# EasyEDA Pro project ProPrj_11年并联dc_2024-12-13.epro

# Schematic Schematic1
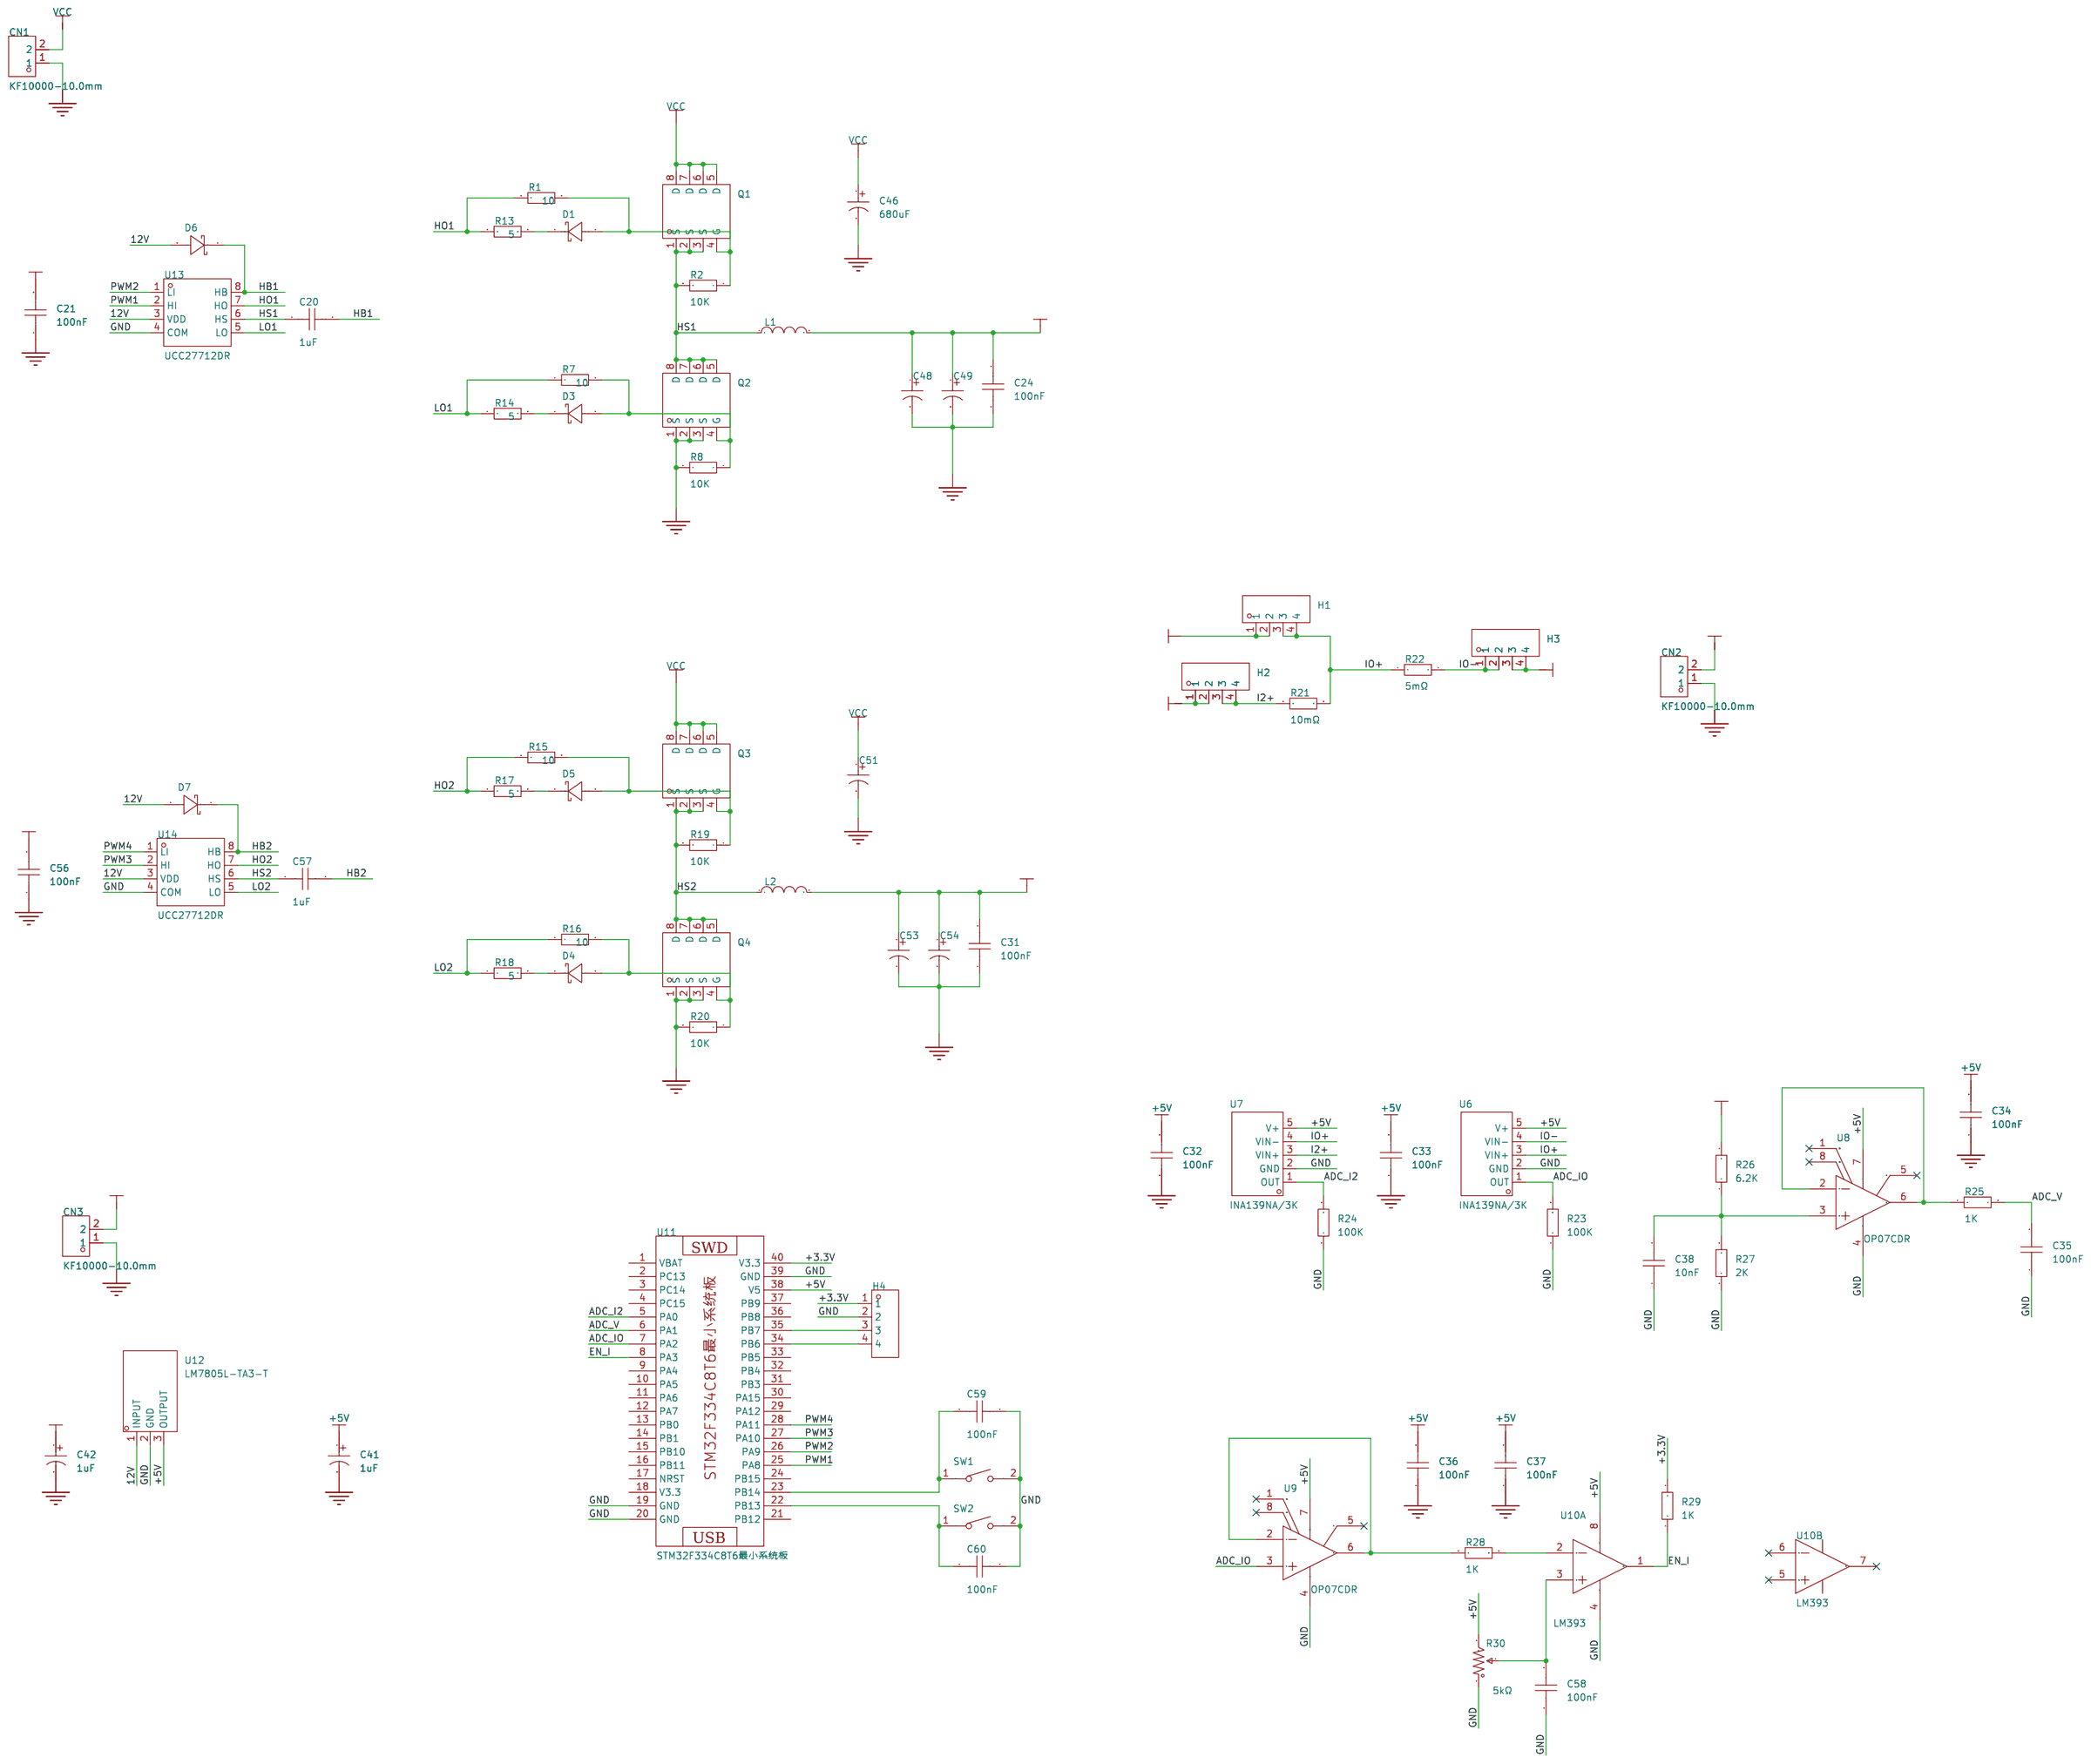
[diagram p0: schematic sheet]

## Parts
C20  1uF  [C0603]
C21  100nF  [C0603]
C24  100nF  [C0603]
C31  100nF  [C0603]
C32  100nF  [C0603]
C33  100nF  [C0603]
C34  100nF  [C0603]
C35  100nF  [C0603]
C36  100nF  [C0603]
C37  100nF  [C0603]
C38  10nF  [C0603]
C41  1uF  [CAP-TH_BD5.0-P2.00-D0.8-FD]
C42  1uF  [CAP-TH_BD5.0-P2.00-D0.8-FD]
C46  680uF  [CAP-TH_BD12.5-P5.00-D0.6-FD]
C48  680uF  [CAP-TH_BD12.5-P5.00-D0.6-FD]
C49  680uF  [CAP-TH_BD12.5-P5.00-D0.6-FD]
C51  680uF  [CAP-TH_BD12.5-P5.00-D0.6-FD]
C53  680uF  [CAP-TH_BD12.5-P5.00-D0.6-FD]
C54  680uF  [CAP-TH_BD12.5-P5.00-D0.6-FD]
C56  100nF  [C0603]
C57  1uF  [C0603]
C58  100nF  [C0603]
C59  100nF  [C0603]
C60  100nF  [C0603]
CN1  KF10000-10.0mm  [CONN-TH_2P-P10.00_KF10000-10.0MM]
CN2  KF10000-10.0mm  [CONN-TH_2P-P10.00_KF10000-10.0MM]
CN3  KF10000-10.0mm  [CONN-TH_2P-P10.00_KF10000-10.0MM]
D1  1N5819WS S4  [SOD-323_L1.6-W1.3-LS2.7-RD]
D3  1N5819WS S4  [SOD-323_L1.6-W1.3-LS2.7-RD]
D4  1N5819WS S4  [SOD-323_L1.6-W1.3-LS2.7-RD]
D5  1N5819WS S4  [SOD-323_L1.6-W1.3-LS2.7-RD]
D6  1N5819WS S4  [SOD-323_L1.6-W1.3-LS2.7-RD]
D7  1N5819WS S4  [SOD-323_L1.6-W1.3-LS2.7-RD]
H1  -  [HDR-TH_4P-P2.54-V-M]
H2  -  [HDR-TH_4P-P2.54-V-M]
H3  -  [HDR-TH_4P-P2.54-V-M]
H4  -  [HDR-TH_4P-P2.54-V-M]
L1  L-SMD1010-PCB  [IND-SMD_L10.0-W10.0-2]
L2  L-SMD1010-PCB  [IND-SMD_L10.0-W10.0-2]
Q1  CSD18540Q5BT  [PDFNWB-8L_L6.0-W5.0-P1.27-BL-EP]
Q2  CSD18540Q5BT  [PDFNWB-8L_L6.0-W5.0-P1.27-BL-EP]
Q3  CSD18540Q5BT  [PDFNWB-8L_L6.0-W5.0-P1.27-BL-EP]
Q4  CSD18540Q5BT  [PDFNWB-8L_L6.0-W5.0-P1.27-BL-EP]
R1  10  [R0603]
R2  10K  [R0603]
R7  10  [R0603]
R8  10K  [R0603]
R13  5  [R0603]
R14  5  [R0603]
R15  10  [R0603]
R16  10  [R0603]
R17  5  [R0603]
R18  5  [R0603]
R19  10K  [R0603]
R20  10K  [R0603]
R21  10mΩ  [R1206]
R22  5mΩ  [R1206]
R23  100K  [R0603]
R24  100K  [R0603]
R25  1K  [R0603]
R26  6.2K  [R0603]
R27  2K  [R0603]
R28  1K  [R0603]
R29  1K  [R0603]
R30  5kΩ  [RES-ADJ-TH_3P-L9.5-W4.85-P2.50-BL-BS]
SW1  轻触按键3*4*H  [SW-SMD_L4.0-W2.9-LS5.0]
SW2  轻触按键3*4*H  [SW-SMD_L4.0-W2.9-LS5.0]
U6  INA139NA/3K  [SOT-23-5_L3.0-W1.7-P0.95-LS2.8-BR]
U7  INA139NA/3K  [SOT-23-5_L3.0-W1.7-P0.95-LS2.8-BR]
U8  OP07CDR  [SOIC-8_L4.9-W3.9-P1.27-LS6.0-BL]
U9  OP07CDR  [SOIC-8_L4.9-W3.9-P1.27-LS6.0-BL]
U10  LM393  [SOP-8_L4.9-W3.9-P1.27-LS6.0-BL]  (sections 1,2)
U11  STM32F334C8T6最小系统板  [STM32F103C8T6核心板]
U12  LM7805L-TA3-T  [TO-220IS_L10.16-W4.7-P2.54-L]
U13  UCC27712DR  [SOIC-8_L4.9-W3.9-P1.27-LS6.0-BL]
U14  UCC27712DR  [SOIC-8_L4.9-W3.9-P1.27-LS6.0-BL]

## Library data of the parts
C20 C21 C24 C31-C38 C56-C60 = CAP_0603: Supplier Footprint: 0603
C41 C42 = KF010M050C110A: 容值:1uF;精度:±20%;额定电压:50V;; LCSC Part Name: 1uF ±20% 50V; Supplier Part: C62934; Manufacturer: CapXon(丰宾); Supplier Footprint: 插件,D5xL11mm; JLCPCB Part Class: 扩展库; Datasheet: https://atta.szlcsc.com/upload/public/pdf/source/20160702/1467448308274.pdf; Supplier: LCSC; Tolerance: ±20%; Rated Voltage: 50V; Lead Spacing: 2mm; φD: 5mm; L: 11mm; Lifetime @ Temp: 2000hrs@105℃
C46 C48 C49 C51 C53 C54 = ERR1JM681W25OT: 容值:680uF;精度:±20%;额定电压:63V;; LCSC Part Name: 680uF ±20% 63V; Supplier Part: C106632; Manufacturer: AISHI(艾华集团); Supplier Footprint: 插件,D12.5xL25mm; JLCPCB Part Class: 扩展库; Datasheet: https://atta.szlcsc.com/upload/public/pdf/source/20190702/C401591_1676EF45BC9A88BD1D6B22BBAE3913C7.pdf; Supplier: LCSC; Tolerance: ±20%; Rated Voltage: 63V; Lead Spacing: 5mm; φD: 12.5mm; L: 25mm; Lifetime @ Temp: 2000hrs@105℃
CN1-CN3 = KF10000-10.0mm: Supplier Part: C9900018859; JLCPCB Part Class: 扩展库; Supplier: LCSC
D1 D3-D7 = 1N5819WS S4_C2927280: 二极管配置:独立式;正向压降(Vf):600mV@200mA;直流反向耐压(Vr):40V;平均整流电流(Io):350mA;; LCSC Part Name: 电压:40V 电流:350mA; Supplier Part: C2927280; Manufacturer: JSMSEMI(杰盛微); Supplier Footprint: SOD-323; JLCPCB Part Class: 扩展库; Datasheet: https://atta.szlcsc.com/upload/public/pdf/source/20240105/574E572B69D2DF1CD36E5C05FAB269C4.pdf; Supplier: LCSC; Diode Configuration: 独立式; Forward Voltage (Vf@If): 600mV@200mA; Reverse Voltage (Vr): 40V; Average Rectified Current (Io): 350mA; Reverse Leakage Current (Ir): 5uA@30V
H1-H4 = HDR-M_2.54_1x4P: Supplier Part: C492403; Supplier Footprint: 插件
L1 L2 = L-SMD1010-PCB: Supplier Part: C9900024506; Supplier Footprint: 贴片电感; JLCPCB Part Class: 扩展库; Supplier: LCSC
Q1-Q4 = CSD18540Q5BT: 60V、N 通道 NexFET&#153; 功率 MOSFET 8-VSON-CLIP -55 to 175; Supplier Part: C2863985; Manufacturer: TI(德州仪器); Supplier Footprint: VSON-CLIP-8(6x5); JLCPCB Part Class: 扩展库; Supplier: LCSC
R1 R2 R7 R8 R13-R20 R23-R29 = Res_0603: Supplier Footprint: 0603
R21 R22 = Res_1206: Supplier Footprint: 1206
R30 = 3296W-1-502: 阻值:5kΩ;精度:±10%;; LCSC Part Name: 5kΩ ±10%; Supplier Part: C118907; Manufacturer: BOCHEN(博晨); Supplier Footprint: 插件; JLCPCB Part Class: 扩展库; Datasheet: https://atta.szlcsc.com/upload/public/pdf/source/20171114/C118907_15106326547951117397.pdf; Supplier: LCSC; Tolerance: ±10%
SW1 SW2 = 轻触按键3*4*H: Supplier Part: C9900017573; Supplier Footprint: 轻触按键3*4*2.5; JLCPCB Part Class: 扩展库; Supplier: LCSC
U6 U7 = INA139NA/3K: INA139 36V、高侧、高速、电流输出电流分流监控器; Supplier Part: C129947; Manufacturer: TI(德州仪器); Supplier Footprint: SOT-23-5; JLCPCB Part Class: 扩展库; Datasheet: https://www.ti.com/cn/lit/gpn/ina139; Supplier: LCSC; Supply Voltage: 2.7V~40V; Operating Temperature: -40℃~+125℃
U8 U9 = OP07CDR: 放大器数:单路;增益带宽积(GBP):600kHz;输入偏置电流(Ib):1.8nA;压摆率(SR):0.3V/us;轨到轨:-;; LCSC Part Name: 精密运算放大器; Supplier Part: C7433; Manufacturer: TI(德州仪器); Supplier Footprint: SOIC-8; JLCPCB Part Class: 基础库; Datasheet: http://www.ti.com/cn/lit/gpn/op07c; Supplier: LCSC; Number of Circuits: 单路; Gain Bandwidth Product(GBP): 600kHz; Current - Input Bias(Ib): 1.8nA; Slew Rate(SR): 0.3V/us; Operating Temperature: 0℃~+70℃
U10 = LM393_C400839: 输入失调电压(Vos):3mV;输入偏置电流(Ib):-;轨到轨:-;; Supplier Part: C400839; Manufacturer: IDCHIP(英锐芯); Supplier Footprint: SOP-8; JLCPCB Part Class: 扩展库; Datasheet: https://atta.szlcsc.com/upload/public/pdf/source/20240308/5ED8EE163AE67417F731F81F7E9D3786.pdf; Supplier: LCSC; Input Offset Voltage (Vos): 3mV; Supply Voltage: 24V; Supply Current: 2.5mA
U11 = STM32F103C8T6最小系统板: tags: STM32; Supplier Part: C8734; Manufacturer: 无; Manufacturer Part: STM32F103C8T6最小系统模块; image: http://image.lceda.cn/szlcsc/C8734.jpg; JLCPCB Part Class: Basic Part
U12 = LM7805L-TA3-T_C340686: 输出类型:-;; Supplier Part: C340686; Supplier Footprint: TO-220IS; JLCPCB Part Class: 扩展库; Supplier: LCSC
U13 U14 = UCC27712DR: 驱动配置:半桥;负载类型:MOSFET；IGBT;驱动通道数:2;峰值灌电流:2.8A;峰值拉电流:1.8A;电源电压:10V~20V;上升时间:16ns;下降时间:10ns;; Supplier Part: C485818; Manufacturer: TI(德州仪器); Supplier Footprint: SOIC-8; JLCPCB Part Class: 扩展库; Datasheet: https://www.ti.com/cn/lit/gpn/ucc27712; Supplier: LCSC; Driven Configuration: 半桥; Load Type: MOSFET；IGBT; Number of Drivers: 2; Peak Output Current(sink): 2.8A; Peak Output Current(source): 1.8A; Supply Voltage: 10V~20V; Rise Time: 16ns; Fall Time: 10ns; Operating Temperature: -40℃~+125℃@(Tj)

## Nets
12V: C21.2 C42.1 C56.2 CN3.2 D6.2(A) D7.2(A) U12.1(INPUT) U13.3(VDD) U14.3(VDD)
+3.3V: H4.1 R29.2 U11.40(V3.3)
+5V: C32.2 C33.2 C34.2 C36.2 C37.2 C41.1 R30.3 U6.5(V+) U7.5(V+) U8.7(VCC+) U9.7(VCC+) U10.8(VCC) U11.38(V5) U12.3(OUTPUT)
GND: C21.1 C24.1 C31.1 C32.1 C33.1 C34.1 C35.1 C36.1 C37.1 C38.1 C41.2 C42.2 C46.2 C48.2 C49.2 C51.2 C53.2 C54.2 C56.1 C58.1 C59.2 C60.2 CN1.1 CN2.1 CN3.1 H4.2 Q2.1(S) Q2.2(S) Q2.3(S) Q4.1(S) Q4.2(S) Q4.3(S) R8.2 R20.2 R23.1 R24.1 R27.1 R30.1 SW1.2 SW2.2 U6.2(GND) U7.2(GND) U8.4(VCC-) U9.4(VCC-) U10.4(GND) U11.19(GND) U11.20(GND) U11.39(GND) U12.2(GND) U13.4(COM) U14.4(COM)
VCC: C46.1 C51.1 CN1.2 Q1.5(D) Q1.6(D) Q1.7(D) Q1.8(D) Q3.5(D) Q3.6(D) Q3.7(D) Q3.8(D)
ADC_I2: R24.2 U7.1(OUT) U11.5(PA0)
ADC_IO: R23.2 U6.1(OUT) U9.3(IN+) U11.7(PA2)
ADC_V: C35.2 R25.2 U11.6(PA1)
EN_I: R29.1 U10.1(OUTA) U11.8(PA3)
HB1: C20.2 D6.1(C) U13.8(HB)
HB2: C57.2 D7.1(C) U14.8(HB)
HO1: R1.1 R13.1 U13.7(HO)
HO2: R15.1 R17.1 U14.7(HO)
HS1: C20.1 L1.1 Q1.1(S) Q1.2(S) Q1.3(S) Q2.5(D) Q2.6(D) Q2.7(D) Q2.8(D) R2.2 U13.6(HS)
HS2: C57.1 L2.1 Q3.1(S) Q3.2(S) Q3.3(S) Q4.5(D) Q4.6(D) Q4.7(D) Q4.8(D) R19.2 U14.6(HS)
I2+: H2.3 H2.4 R21.1 U7.3(VIN+)
IO+: H1.3 H1.4 R21.2 R22.1 U6.3(VIN+) U7.4(VIN-)
IO-: H3.1 H3.2 R22.2 U6.4(VIN-)
LO1: R7.1 R14.1 U13.5(LO)
LO2: R16.1 R18.1 U14.5(LO)
OUT: CN2.2 H3.3 H3.4 R26.2
OUT1: C24.2 C48.1 C49.1 H1.1 H1.2 L1.2
OUT2: C31.2 C53.1 C54.1 H2.1 H2.2 L2.2
PWM1: U11.25(PA8) U13.2(HI)
PWM2: U11.26(PA9) U13.1(LI)
PWM3: U11.27(PA10) U14.2(HI)
PWM4: U11.28(PA11) U14.1(LI)
$1N1590: D3.2(A) Q2.4(G) R7.2 R8.1
$1N2076: D1.1(C) R13.2
$1N2109: D3.1(C) R14.2
$1N2257: D1.2(A) Q1.4(G) R1.2 R2.1
$1N3536: D4.2(A) Q4.4(G) R16.2 R20.1
$1N3551: D5.1(C) R17.2
$1N3553: D5.2(A) Q3.4(G) R15.2 R19.1
$1N3586: D4.1(C) R18.2
$1N4574: R25.1 U8.2(IN-) U8.6(OUT)
$1N4775: C38.2 R26.1 R27.2 U8.3(IN+)
$1N5405: R28.2 U10.2(INA-)
$1N5413: R28.1 U9.2(IN-) U9.6(OUT)
$1N5568: C58.2 R30.2 U10.3(INA+)
$1N10041: H4.3 U11.35(PB7)
$1N10045: H4.4 U11.34(PB6)
$1N10154: C59.1 SW1.1 U11.23(PB14)
$1N10159: C60.1 SW2.1 U11.22(PB13)

Not connected (* = marked no-connect by the designer): U8 1(OFFSET N1)* 5(NC)* 8(OFFSET N2)*; U9 1(OFFSET N1)* 5(NC)* 8(OFFSET N2)*; U10 5(INB+)* 6(INB-)* 7(OUTB)*; U11 1(VBAT) 2(PC13) 3(PC14) 4(PC15) 9(PA4) 10(PA5) 11(PA6) 12(PA7) 13(PB0) 14(PB1) 15(PB10) 16(PB11) 17(NRST) 18(V3.3) 21(PB12) 24(PB15) 29(PA12) 30(PA15) 31(PB3) 32(PB4) 33(PB5) 36(PB8) 37(PB9)

# Board PCB1
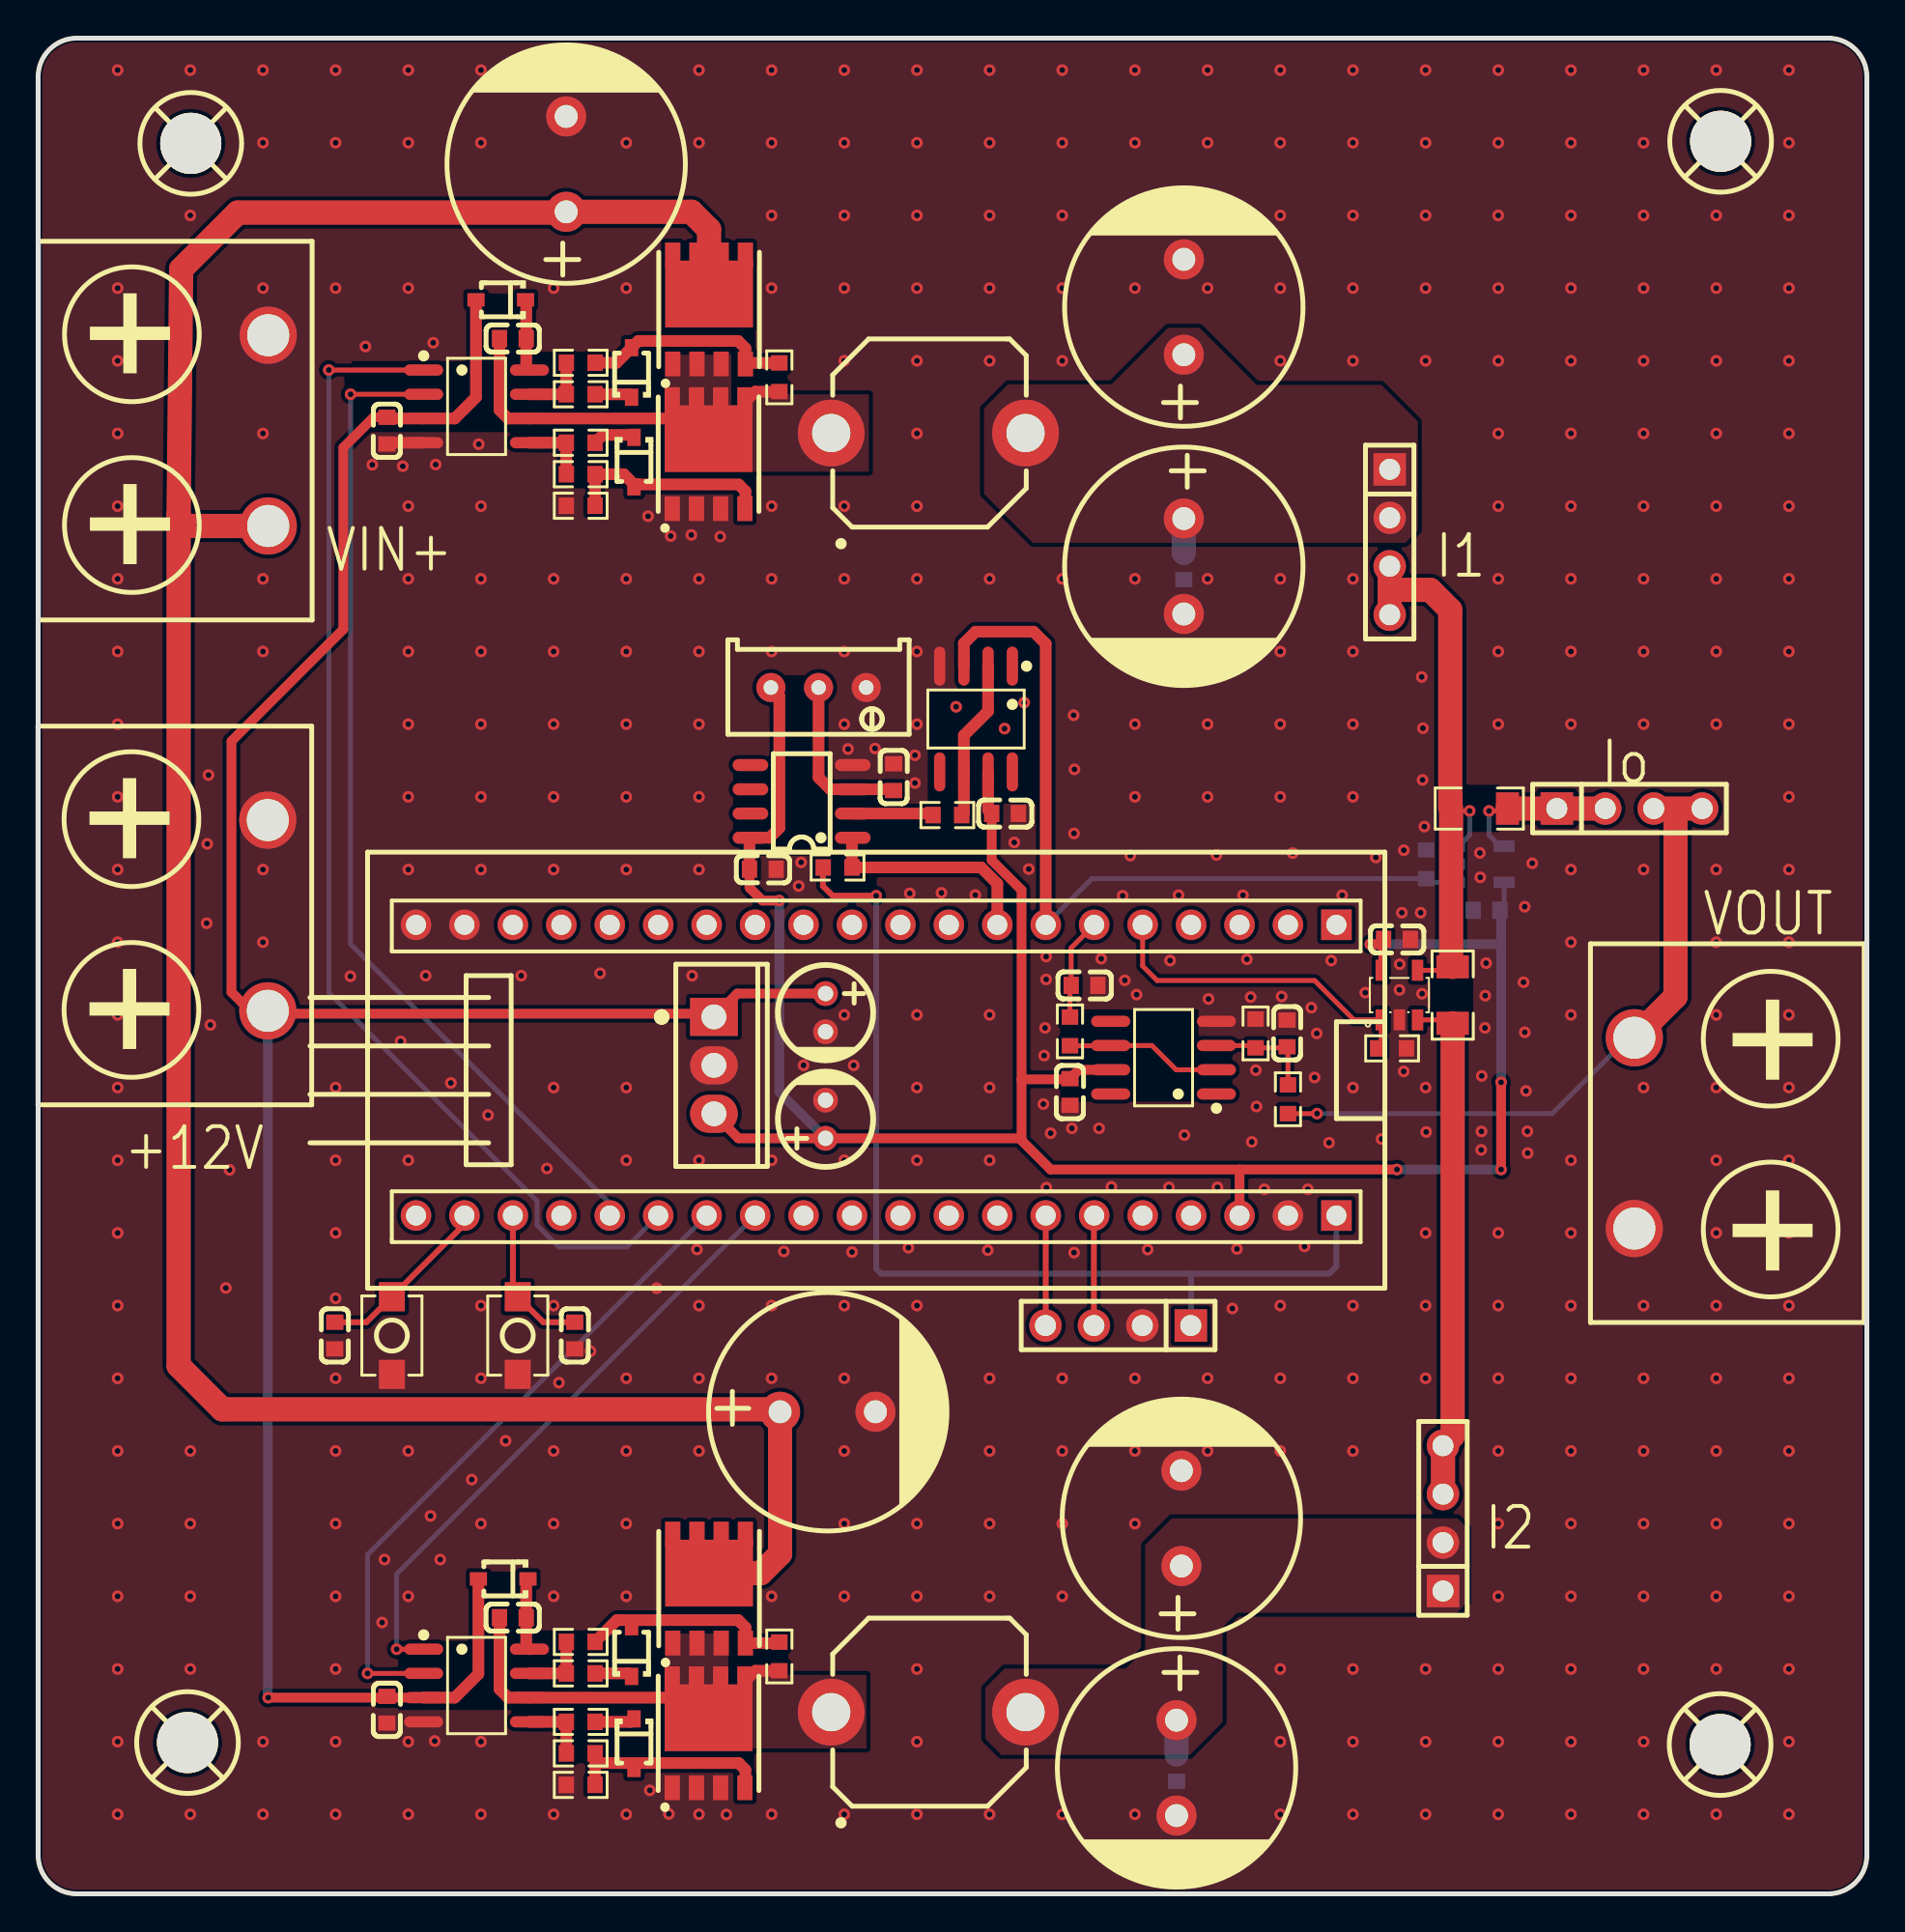
[diagram p1: board, top side]
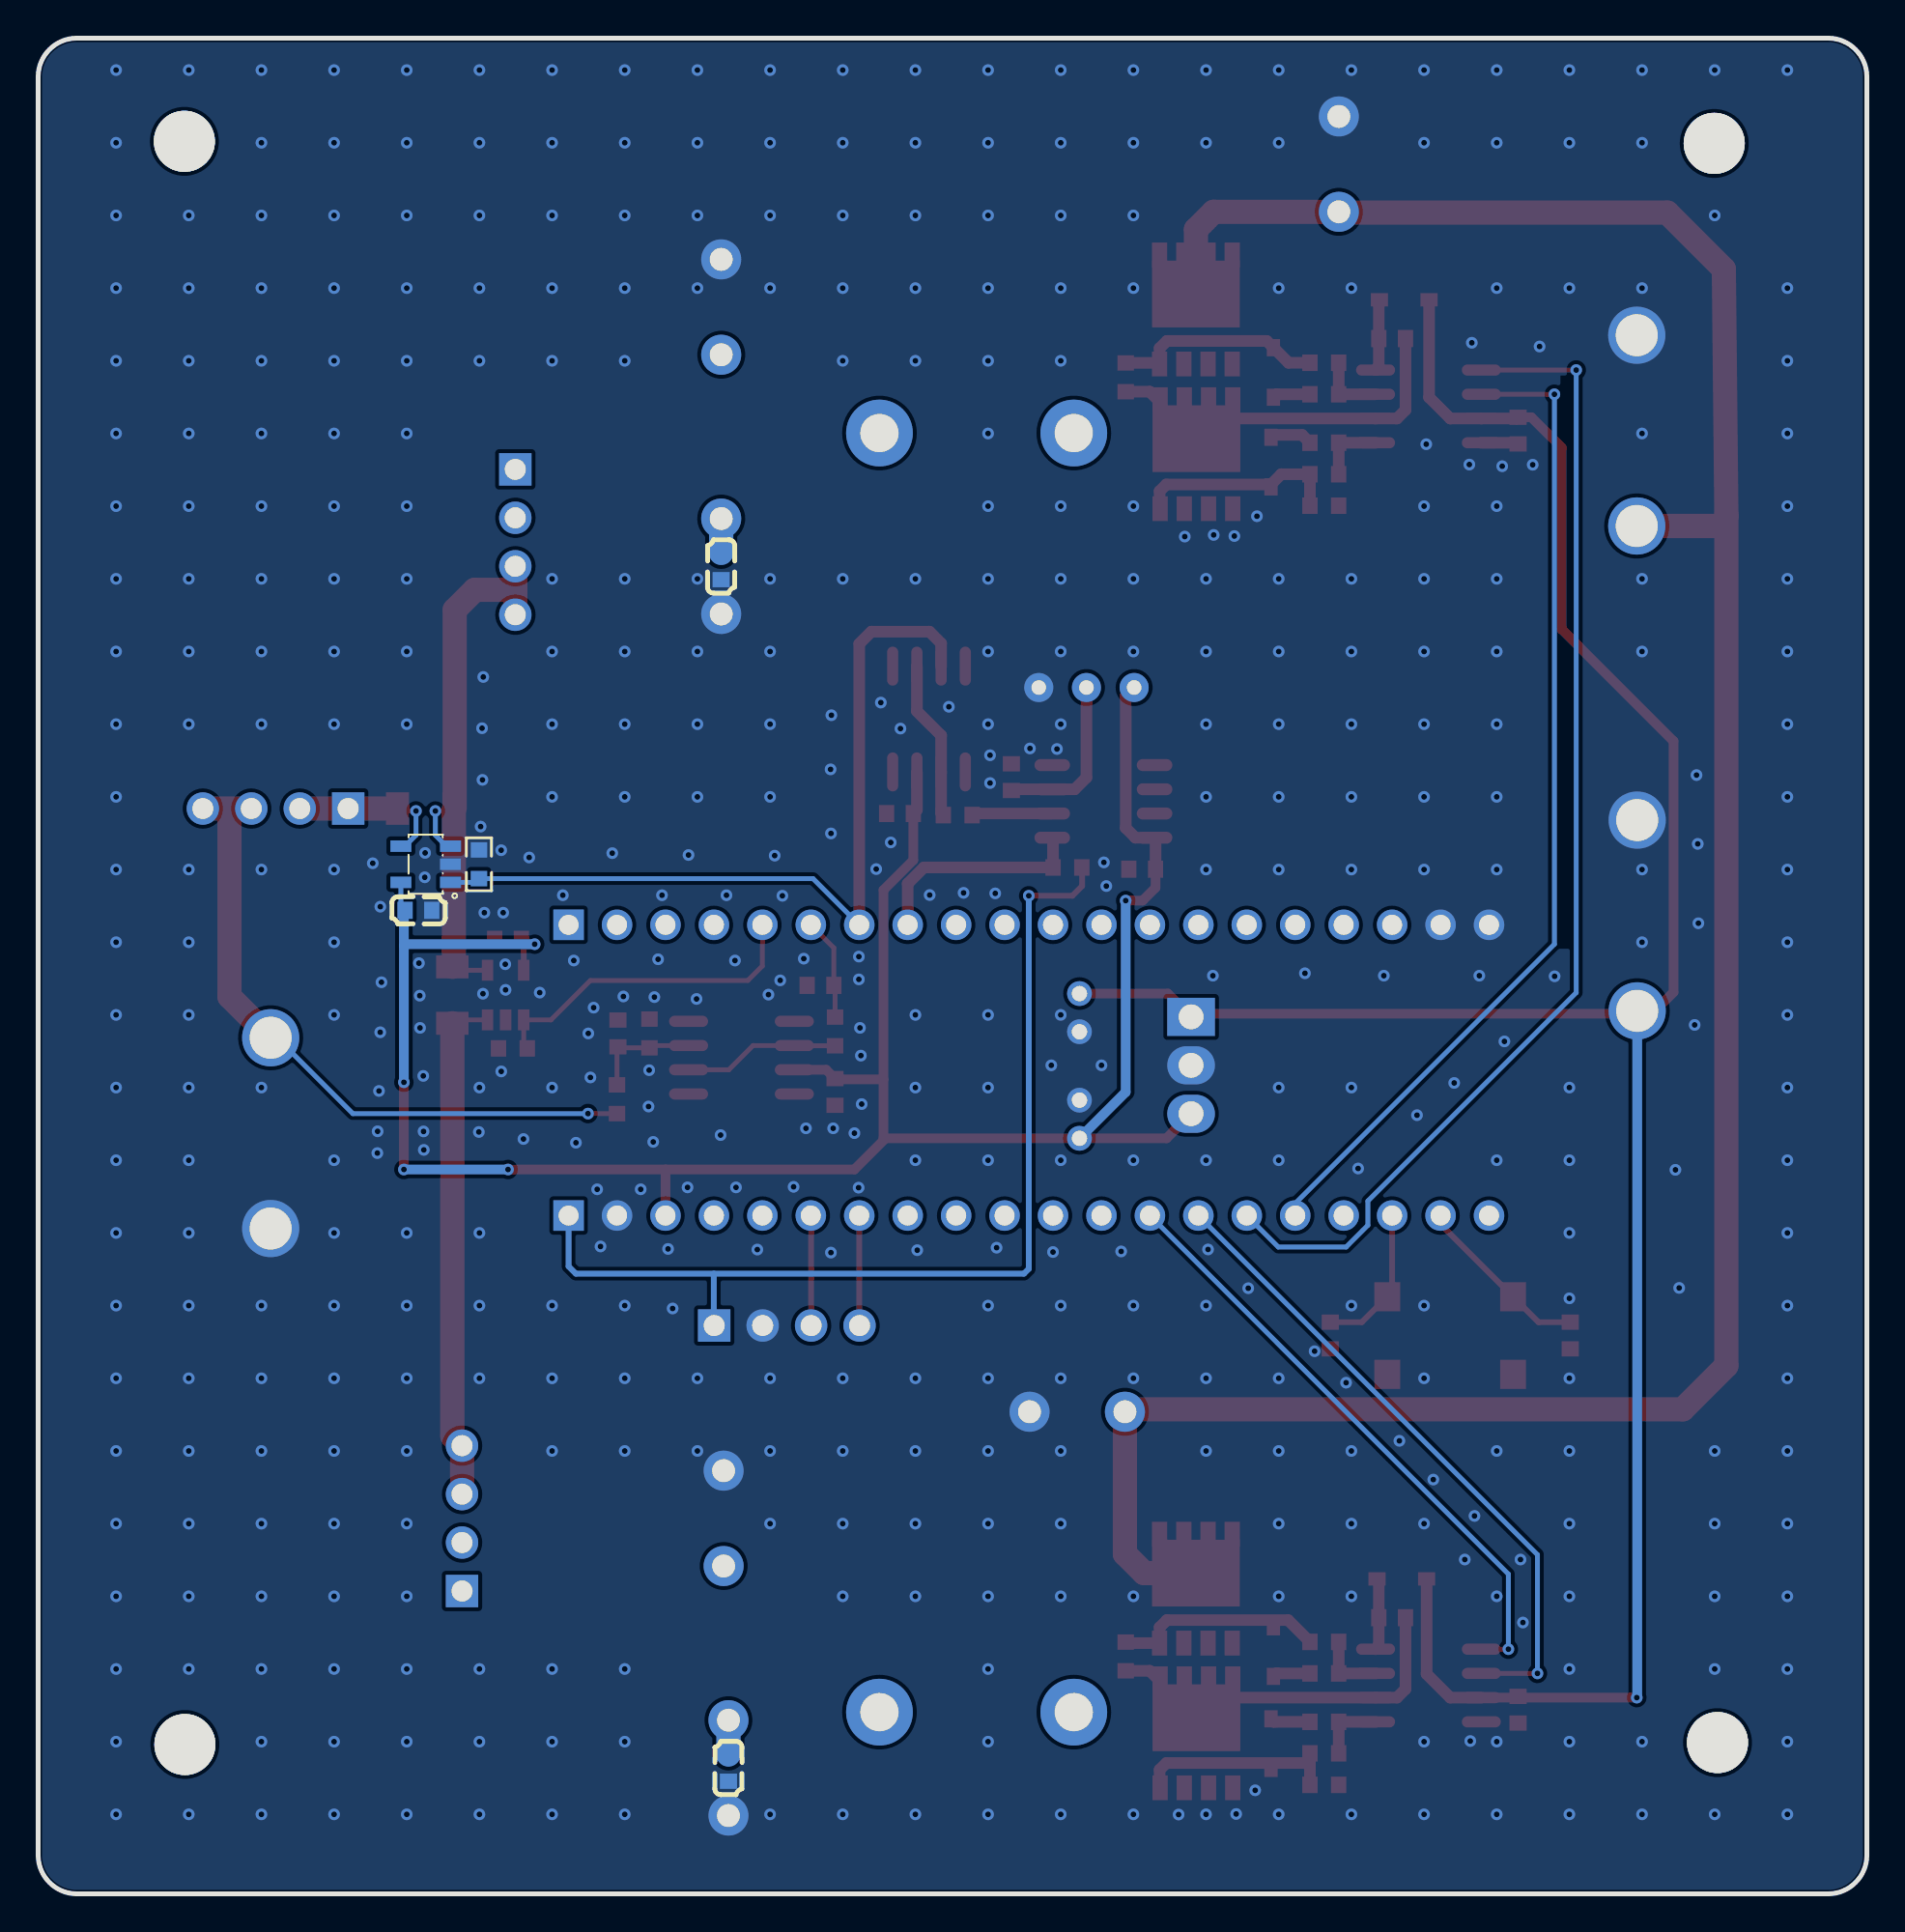
[diagram p2: board, bottom side, seen from below]

Outline 95.89 x 97.28 mm; copper layers: Top Layer, Bottom Layer. Coordinates in mm from the lower left corner of the outline.
Outline path: 0,95.25 0,2.03 arc(0.6,0.6) 2.03,0 93.85,0 arc(95.29,0.6) 95.89,2.03 95.89,95.25 arc(95.29,96.69) 93.85,97.28 2.03,97.28 arc(0.6,96.69) 0,95.25
Stack: Top Layer 0.035mm / Dielectric1 1.51mm FR4 er 4.5 / Bottom Layer 0.035mm

## Design rules (mm)
template: 自定义配置
spacing copperThickness1oz (default): track to track 0.102, other pairs 0.152 to 0.3
spacing copperThickness2oz: track to track 0.203, other pairs 0.152 to 0.3
track width copperThickness1oz (default): min 0.127, default 0.254, max 2.54
track width copperThickness2oz: min 0.203, default 0.254, max 2.54
differential pair differentialPair (default): width min 0.127, default 0.254, max 2.54; gap min 0.152, default 0.152
via viaSize (default): diameter min 0.5, default 0.61, max 10; hole min 0.3, default 0.305, max 6.3

## Placement (name value [footprint] x y rotation side)
C20  1uF  [C0603]  24.89 81.53 0 top
C21  100nF  [C0603]  18.29 76.71 90 top
C24  100nF  [C0603]  60.07 69.6 90 bottom
C31  100nF  [C0603]  59.69 6.6 90 bottom
C32  100nF  [C0603]  71.25 50.04 180 top
C33  100nF  [C0603]  75.95 51.56 0 bottom
C34  100nF  [C0603]  54.1 42.04 90 top
C35  100nF  [C0603]  54.86 47.62 180 top
C36  100nF  [C0603]  50.7 56.64 180 top
C37  100nF  [C0603]  38 53.71 180 top
C38  10nF  [C0603]  65.49 45.11 270 top
C41  1uF  [CAP-TH_BD5.0-P2.00-D0.8-FD]  41.28 40.61 90 top
C42  1uF  [CAP-TH_BD5.0-P2.00-D0.8-FD]  41.28 46.2 270 top
C46  680uF  [CAP-TH_BD12.5-P5.00-D0.6-FD]  27.69 90.68 90 top
C48  680uF  [CAP-TH_BD12.5-P5.00-D0.6-FD]  60.07 69.6 270 top
C49  680uF  [CAP-TH_BD12.5-P5.00-D0.6-FD]  60.07 83.19 90 top
C51  680uF  [CAP-TH_BD12.5-P5.00-D0.6-FD]  41.4 25.27 0 top
C53  680uF  [CAP-TH_BD12.5-P5.00-D0.6-FD]  59.69 6.6 270 top
C54  680uF  [CAP-TH_BD12.5-P5.00-D0.6-FD]  59.94 19.69 90 top
C56  100nF  [C0603]  18.29 9.65 90 top
C57  1uF  [C0603]  24.89 14.48 0 top
C58  100nF  [C0603]  44.86 58.54 270 top
C59  100nF  [C0603]  28.14 29.27 270 top
C60  100nF  [C0603]  15.55 29.27 270 top
CN1  KF10000-10.0mm  [CONN-TH_2P-P10.00_KF10000-10.0MM]  12.07 76.71 270 top
CN2  KF10000-10.0mm  [CONN-TH_2P-P10.00_KF10000-10.0MM]  83.69 39.88 90 top
CN3  KF10000-10.0mm  [CONN-TH_2P-P10.00_KF10000-10.0MM]  12.04 51.29 270 top
D1  1N5819WS S4  [SOD-323_L1.6-W1.3-LS2.7-RD]  31.12 79.76 90 top
D3  1N5819WS S4  [SOD-323_L1.6-W1.3-LS2.7-RD]  31.24 75.06 270 top
D4  1N5819WS S4  [SOD-323_L1.6-W1.3-LS2.7-RD]  31.24 7.87 270 top
D5  1N5819WS S4  [SOD-323_L1.6-W1.3-LS2.7-RD]  31.12 12.7 90 top
D6  1N5819WS S4  [SOD-323_L1.6-W1.3-LS2.7-RD]  24.26 83.57 180 top
D7  1N5819WS S4  [SOD-323_L1.6-W1.3-LS2.7-RD]  24.38 16.51 180 top
H1  -  [HDR-TH_4P-P2.54-V-M]  70.87 70.87 270 top
H2  -  [HDR-TH_4P-P2.54-V-M]  73.66 19.69 90 top
H3  -  [HDR-TH_4P-P2.54-V-M]  83.44 56.9 0 top
H4  -  [HDR-TH_4P-P2.54-V-M]  56.63 29.79 180 top
L1  L-SMD1010-PCB  [IND-SMD_L10.0-W10.0-2]  46.74 76.58 0 top
L2  L-SMD1010-PCB  [IND-SMD_L10.0-W10.0-2]  46.74 9.53 0 top
Q1  CSD18540Q5BT  [PDFNWB-8L_L6.0-W5.0-P1.27-BL-EP]  35.18 83.06 0 top
Q2  CSD18540Q5BT  [PDFNWB-8L_L6.0-W5.0-P1.27-BL-EP]  35.15 75.47 0 top
Q3  CSD18540Q5BT  [PDFNWB-8L_L6.0-W5.0-P1.27-BL-EP]  35.18 16 0 top
Q4  CSD18540Q5BT  [PDFNWB-8L_L6.0-W5.0-P1.27-BL-EP]  35.15 8.42 0 top
R1  10  [R0603]  28.45 80.26 0 top
R2  10K  [R0603]  38.86 79.5 270 top
R7  10  [R0603]  28.45 74.42 0 top
R8  10K  [R0603]  28.45 72.77 180 top
R13  5  [R0603]  28.45 78.61 0 top
R14  5  [R0603]  28.45 76.07 0 top
R15  10  [R0603]  28.45 13.21 0 top
R16  10  [R0603]  28.45 7.37 0 top
R17  5  [R0603]  28.45 11.56 0 top
R18  5  [R0603]  28.45 9.02 0 top
R19  10K  [R0603]  38.86 12.45 270 top
R20  10K  [R0603]  28.45 5.72 180 top
R21  10mΩ  [R1206]  74.17 47.12 90 top
R22  5mΩ  [R1206]  75.56 56.9 0 top
R23  100K  [R0603]  72.77 53.97 270 bottom
R24  100K  [R0603]  70.99 44.32 180 top
R25  1K  [R0603]  54.1 45.21 90 top
R26  6.2K  [R0603]  65.53 41.66 270 top
R27  2K  [R0603]  63.83 45.11 270 top
R28  1K  [R0603]  47.67 56.55 180 top
R29  1K  [R0603]  41.92 53.81 180 top
R30  5kΩ  [RES-ADJ-TH_3P-L9.5-W4.85-P2.50-BL-BS]  40.92 63.24 270 top
SCREW1  -  [M3螺丝]  8 91.77 0 top
SCREW1#2  -  [M3螺丝]  88.22 91.87 0 top
SCREW1#3  -  [M3螺丝]  88.19 7.83 0 top
SCREW1#4  -  [M3螺丝]  7.83 7.93 0 top
SW1  轻触按键3*4*H  [SW-SMD_L4.0-W2.9-LS5.0]  25.15 29.27 270 top
SW2  轻触按键3*4*H  [SW-SMD_L4.0-W2.9-LS5.0]  18.55 29.27 270 top
U6  INA139NA/3K  [SOT-23-5_L3.0-W1.7-P0.95-LS2.8-BR]  75.56 53.97 180 bottom
U7  INA139NA/3K  [SOT-23-5_L3.0-W1.7-P0.95-LS2.8-BR]  71.37 47.12 270 top
U8  OP07CDR  [SOIC-8_L4.9-W3.9-P1.27-LS6.0-BL]  59.01 43.84 90 top
U9  OP07CDR  [SOIC-8_L4.9-W3.9-P1.27-LS6.0-BL]  49.17 61.59 180 top
U10  LM393  [SOP-8_L4.9-W3.9-P1.27-LS6.0-BL]  40.03 57.27 90 top
U11  STM32F334C8T6最小系统板  [STM32F103C8T6核心板]  43.94 43.18 270 top
U12  LM7805L-TA3-T  [TO-220IS_L10.16-W4.7-P2.54-L]  35.43 43.43 270 top
U13  UCC27712DR  [SOIC-8_L4.9-W3.9-P1.27-LS6.0-BL]  22.99 77.98 270 top
U14  UCC27712DR  [SOIC-8_L4.9-W3.9-P1.27-LS6.0-BL]  22.99 10.92 270 top

## Footprints (pads in the part's own frame, mm; a bottom-side part is the same pattern mirrored in y, then rotated)
C0603
  rect 0.8x0.9 smd: 1(-0.7,0) 2(0.7,0)
CAP-TH_BD5.0-P2.00-D0.8-FD
  round 1.3 hole 0.8: 1(-1,0) 2(1,0)
CAP-TH_BD12.5-P5.00-D0.6-FD
  round 2.1 hole 1.2: 1(-2.5,0) 2(2.5,0)
CONN-TH_2P-P10.00_KF10000-10.0MM
  round 3 hole 2.2: 1(-5,0) 2(5,0)
HDR-TH_4P-P2.54-V-M
  rect 1.7x1.7 hole 1.1: 1(-3.81,0)
  round 1.7 hole 1.1: 2(-1.27,0) 3(1.27,0) 4(3.81,0)
IND-SMD_L10.0-W10.0-2
  round 3.5 hole 2: 1(-5.152,0) 2(5.037,0)
M3螺丝
  round 3.2 hole 3.2: 1(0,0)
PDFNWB-8L_L6.0-W5.0-P1.27-BL-EP
  rect 0.8x1.3 smd: 1(-1.905,-2.857) 2(-0.635,-2.857) 3(0.635,-2.857) 4(1.905,-2.857) 5(1.905,2.857) 6(0.635,2.857) 7(-0.635,2.857) 8(-1.905,2.857)
  rect 4.6x3.5 smd: 8(0,0.812)
R0603
  rect 0.806x0.864 smd: 1(-0.753,0) 2(0.753,0)
R1206
  rect 1.208x1.701 smd: 1(-1.479,0) 2(1.479,0)
RES-ADJ-TH_3P-L9.5-W4.85-P2.50-BL-BS
  round 1.524 hole 0.762: 1(0,2.5) 2(0,0) 3(0,-2.5)
SOD-323_L1.6-W1.3-LS2.7-RD
  rect 0.9x0.7 smd: 1(-1.3,0) 2(1.3,0)
SOIC-8_L4.9-W3.9-P1.27-LS6.0-BL
  oval 0.588x2.045 smd: 1(-1.905,-2.772) 2(-0.635,-2.772) 3(0.635,-2.772) 4(1.905,-2.772) 5(1.905,2.772) 6(0.635,2.772) 7(-0.635,2.772) 8(-1.905,2.772)
SOP-8_L4.9-W3.9-P1.27-LS6.0-BL
  oval 0.63x1.865 smd: 1(-1.905,-2.683) 2(-0.635,-2.683) 3(0.635,-2.683) 4(1.905,-2.683) 5(1.905,2.683) 6(0.635,2.683) 7(-0.635,2.683) 8(-1.905,2.683)
SOT-23-5_L3.0-W1.7-P0.95-LS2.8-BR
  rect 1.1x0.6 smd: 1(1.3,-0.95) 2(1.3,0) 3(1.3,0.95) 4(-1.3,0.95) 5(-1.3,-0.95)
STM32F103C8T6核心板
  rect 1.6x1.6 hole 1.049: 1(-7.62,24.13) 40(7.62,24.13)
  round 1.6 hole 1.049: 2(-7.62,21.59) 3(-7.62,19.05) 4(-7.62,16.51) 5(-7.62,13.97) 6(-7.62,11.43) 7(-7.62,8.89) 8(-7.62,6.35) 9(-7.62,3.81) 10(-7.62,1.27) 11(-7.62,-1.27) 12(-7.62,-3.81) 13(-7.62,-6.35) 14(-7.62,-8.89) 15(-7.62,-11.43) 16(-7.62,-13.97) 17(-7.62,-16.51) 18(-7.62,-19.05) 19(-7.62,-21.59) 20(-7.62,-24.13) 21(7.62,-24.13) 22(7.62,-21.59) 23(7.62,-19.05) 24(7.62,-16.51) 25(7.62,-13.97) 26(7.62,-11.43) 27(7.62,-8.89) 28(7.62,-6.35) 29(7.62,-3.81) 30(7.62,-1.27) 31(7.62,1.27) 32(7.62,3.81) 33(7.62,6.35) 34(7.62,8.89) 35(7.62,11.43) 36(7.62,13.97) 37(7.62,16.51) 38(7.62,19.05) 39(7.62,21.59)
SW-SMD_L4.0-W2.9-LS5.0
  rect 1.53x1.36 smd: 1(-2.035,0) 2(2.035,0)
TO-220IS_L10.16-W4.7-P2.54-L
  rect 2x2.5 hole 1.3: 1(-2.54,0)
  oval 2x2.5 hole 1.3: 2(0,0) 3(2.54,0)

## Nets
As in the schematic.

Pads without a net: SCREW1 1; SCREW1#2 1; SCREW1#3 1; SCREW1#4 1; U8 1 5 8; U9 1 5 8; U10 5 6 7; U11 1 2 3 4 9 10 11 12 13 14 15 16 17 18 21 24 29 30 31 32 33 36 37

## Via types
v1: diameter 0.61, hole 0.305, Top Layer to Bottom Layer, 519 vias

## Routing (per net, layer and track width the routed paths; a pad name or vN(x,y) marks a point on that pad's centre or on a via; arc(x,y) is an arc through that point)
12V: length 129
  Top Layer w0.508: 35.6,46.14 12.19,46.14 CN3.2 11.11,46.29 10.14,47.27 10.14,60.43 16,66.29 16,75.82 17.59,77.41 C21.2 ; 35.6,46.14 36.65,47.2 C42.1 ; 35.6,46.14 U12.1 ; v1(12.07,10.29) U14.3
  Top Layer w0.61: D7.2 23.08,11.53 21.84,10.29 U14.3 ; C21.2 18.35,77.34 U13.3 21.84,77.34 22.96,78.46 D6.2
  Bottom Layer w0.508: CN3.2 12.04,10.31 v1(12.07,10.29)
+3.3V: length 53.3
  Top Layer w0.305: R29.2 41.15,53.79 41.15,52.83 41.66,52.32 v1(43.94,52.32)
  Bottom Layer w0.305: 60.46,32.51 67.69,32.51 68.07,32.89 68.07,35.56 ; 60.46,32.51 44.2,32.51 43.94,32.77 v1(43.94,52.32) ; 60.46,32.51 60.46,29.82 H4.1
+5V: length 121.4
  Top Layer w0.305: 70.55,50.04 70.42,49.91 U7.5
  Top Layer w0.508: U12.3 36.72,39.61 C41.1 51.45,39.61 ; 51.56,42.7 51.56,39.61 51.45,39.61 ; 51.56,42.7 51.56,52.62 50,54.19 C36.2 ; 51.56,42.7 54.06,42.7 C34.2 54.57,43.2 U8.7 ; C37.2 37.3,52.74 37.97,52.07 v1(38.86,52.07) ; v1(69.85,49.78) 70.29,49.78 70.42,49.91 ; 62.99,37.97 v1(71.25,37.97) ; 62.99,37.97 53.09,37.97 51.45,39.61 ; 62.99,37.97 62.99,35.56 ; v1(76.71,37.97) v1(76.71,42.55)
  Top Layer w0.61: C37.2 37.3,55.32 U10.8 38.35,55.37 38.86,55.88 38.86,62.8 R30.3 ; U9.7 49.81,56.82 C36.2
  Bottom Layer w0.254: U6.5 76.87,51.78 C33.2
  Bottom Layer w0.508: v1(71.25,37.97) v1(76.71,37.97) ; v1(76.71,42.55) 76.71,49.71 ; 76.71,49.71 76.71,51.5 C33.2 ; 76.71,49.71 76.63,49.78 v1(69.85,49.78) ; C41.1 38.86,42.03 v1(38.86,52.07)
GND: length 2
  Top Layer w0.61: U13.4 18.35,76.07 C21.1
  vias: v1(4.17,95.61) v1(4.17,84.18) v1(4.17,80.37) v1(4.17,76.56) v1(4.17,72.75) v1(4.17,68.94) v1(4.17,65.13) v1(4.17,61.32) v1(4.17,57.51) v1(4.17,53.7) v1(4.17,49.89) v1(4.17,46.08) v1(4.17,42.27) v1(4.17,38.46) v1(4.17,34.65) v1(4.17,30.84) v1(4.17,27.03) v1(4.17,23.22) v1(4.17,19.41) v1(4.17,15.6) v1(4.17,11.79) v1(4.17,7.98) v1(4.17,4.17) v1(7.98,95.61) v1(7.98,87.99) v1(7.98,23.22) v1(7.98,19.41) v1(7.98,15.6) v1(7.98,11.79) v1(7.98,4.17) v1(8.87,55.04) v1(8.83,50.88) v1(8.93,58.65) v1(9.03,45.55) v1(9.84,31.76) v1(10.04,37.96) v1(11.79,95.61) v1(11.79,91.8) v1(11.79,84.18) v1(11.79,76.56) v1(11.79,68.94) v1(11.79,65.13) v1(11.79,53.7) v1(11.79,49.89) v1(11.79,7.98) v1(11.79,4.17) v1(15.6,95.61) v1(15.6,91.8) v1(15.6,84.18) v1(15.6,42.27) v1(15.6,38.46) v1(15.6,34.65) v1(15.6,31.22) v1(15.6,27.03) v1(15.6,23.22) v1(15.6,19.41) v1(15.6,15.6) v1(15.6,11.79) v1(15.6,7.98) v1(15.6,4.17) v1(16.37,48.1) v1(17.16,81.12) v1(17.52,74.92) v1(18.03,14.22) v1(18.16,17.53) v1(19.01,44.69) v1(19.12,74.84) v1(19.41,95.61) v1(19.41,91.8) v1(19.41,84.18) v1(19.41,72.75) v1(19.41,68.94) v1(19.41,65.13) v1(19.41,61.32) v1(19.41,57.51) v1(19.41,53.7) v1(19.41,38.46) v1(19.41,23.22) v1(19.41,15.6) v1(19.41,7.98) v1(19.41,4.17) v1(20.32,48.13) v1(20.57,19.81) v1(20.71,81.31) v1(20.79,8.01) v1(20.84,74.93) v1(21.08,17.53) v1(21.64,42.51) v1(22.73,21.72) v1(23.1,76) v1(23.22,95.61) v1(23.22,91.8) v1(23.22,72.75) v1(23.22,68.94) v1(23.22,65.13) v1(23.22,61.32) v1(23.22,57.51) v1(23.22,53.7) v1(23.22,30.84) v1(23.22,27.03) v1(23.22,19.41) v1(23.22,7.98) v1(23.22,4.17) v1(23.59,40.82) v1(24.51,23.75) v1(25.33,48.13) v1(26.68,38.03) v1(27.03,95.61) v1(27.03,84.18) v1(27.03,68.94) v1(27.03,65.13) v1(27.03,61.32) v1(27.03,57.51) v1(27.03,53.7) v1(27.03,42.27) v1(27.03,30.84) v1(27.03,23.22) v1(27.03,19.41) v1(27.03,15.6) v1(27.03,4.17) v1(27.31,26.8) v1(28.96,28.45) v1(29.46,48.26) v1(30.84,95.61) v1(30.84,91.8) v1(30.84,84.18) v1(30.84,68.94) v1(30.84,65.13) v1(30.84,61.32) v1(30.84,57.51) v1(30.84,53.7) v1(30.84,42.27) v1(30.84,38.46) v1(30.84,27.03) v1(30.84,23.22) v1(30.84,19.41) v1(30.84,15.6) v1(30.84,4.17) v1(31.98,72.22) v1(32.07,5.43) v1(32.44,31.75) v1(33.07,4.19) v1(33.16,71.18) v1(34.25,71.24) v1(34.29,48.13) v1(34.54,33.78) v1(34.65,95.61) v1(34.65,91.8) v1(34.65,68.94) v1(34.65,65.13) v1(34.65,61.32) v1(34.65,57.51) v1(34.65,53.7) v1(34.65,38.46) v1(34.65,30.84) v1(34.65,27.03) v1(34.65,23.22) v1(34.65,4.17) v1(35.76,71.15) v1(36.09,4.16) v1(38.46,95.61) v1(38.46,91.8) v1(38.46,87.99) v1(38.46,84.18) v1(38.46,72.75) v1(38.46,68.94) v1(38.46,65.13) v1(38.46,38.46) v1(38.46,30.84) v1(38.46,27.03) v1(38.46,15.6) v1(38.46,4.17) v1(39.1,33.68) v1(39.88,52.83) v1(40,54.07) v1(40.13,43.43) v1(42.27,95.61) v1(42.27,91.8) v1(42.27,87.99) v1(42.27,84.18) v1(42.27,80.37) v1(42.27,72.75) v1(42.27,68.94) v1(42.27,65.13) v1(42.27,61.32) v1(42.27,46.08) v1(42.27,38.46) v1(42.27,30.84) v1(42.27,27.03) v1(42.27,23.22) v1(42.27,19.41) v1(42.27,15.6) v1(42.27,4.17) v1(42.47,60.02) v1(42.67,33.65) v1(42.76,43.43) v1(43.88,60.05) v1(45.7,52.45) v1(45.63,33.87) v1(45.97,59.69) v1(45.97,58.23) v1(46.08,95.61) v1(46.08,91.8) v1(46.08,87.99) v1(46.08,84.18) v1(46.08,80.37) v1(46.08,76.56) v1(46.08,72.75) v1(46.08,68.94) v1(46.08,65.13) v1(46.08,61.32) v1(46.08,46.08) v1(46.08,42.27) v1(46.08,38.46) v1(46.08,30.84) v1(46.08,27.03) v1(46.08,23.22) v1(46.08,19.41) v1(46.08,15.6) v1(46.08,11.79) v1(46.08,7.98) v1(46.08,4.17) v1(47.36,52.48) v1(48.13,62.23) v1(49.14,52.36) v1(49.79,33.74) v1(49.89,95.61) v1(49.89,91.8) v1(49.89,87.99) v1(49.89,84.18) v1(49.89,80.37) v1(49.89,68.94) v1(49.89,46.08) v1(49.89,42.27) v1(49.89,38.46) v1(49.89,27.03) v1(49.89,23.22) v1(49.89,19.41) v1(49.89,15.6) v1(49.89,4.17) v1(50.67,61.09) v1(51.18,55.12) v1(51.7,62.45) v1(51.94,53.72) v1(52.71,41.4) v1(52.79,45.4) v1(52.75,43.94) v1(52.85,49.13) v1(52.85,47.94) v1(52.87,37.02) v1(53.09,39.88) v1(53.7,95.61) v1(53.7,91.8) v1(53.7,87.99) v1(53.7,84.18) v1(53.7,80.37) v1(53.7,68.94) v1(53.7,27.03) v1(53.7,23.22) v1(53.7,19.41) v1(53.7,15.6) v1(53.7,4.17) v1(54.2,40.13) v1(54.29,61.79) v1(54.31,55.59) v1(54.32,33.62) v1(54.34,58.95) v1(55.63,40.13) v1(55.74,49.03) v1(56.28,37.06) v1(56.86,52.32) v1(56.98,47.89) v1(57.27,54.43) v1(57.51,95.61) v1(57.51,91.8) v1(57.51,87.99) v1(57.51,84.18) v1(57.51,68.94) v1(57.51,65.13) v1(57.51,61.32) v1(57.51,57.51) v1(57.51,27.03) v1(57.51,23.22) v1(57.51,19.41) v1(57.51,4.17) v1(57.59,47.14) v1(58.18,33.78) v1(59.29,37.04) v1(59.35,48.93) v1(59.79,52.35) v1(60.1,39.78) v1(61.32,95.61) v1(61.32,91.8) v1(61.32,87.99) v1(61.32,84.18) v1(61.32,68.94) v1(61.32,65.13) v1(61.32,61.32) v1(61.32,57.51) v1(61.32,27.03) v1(61.32,23.22) v1(61.36,46.91) v1(61.78,54.46) v1(61.84,37.04) v1(62.62,30.69) v1(62.86,33.81) v1(63.17,52.35) v1(63.38,48.99) v1(63.57,47.01) v1(63.63,39.42) v1(63.85,43.18) v1(63.88,41.27) v1(64.29,36.93) v1(65.13,95.61) v1(65.13,91.8) v1(65.13,87.99) v1(65.13,84.18) v1(65.13,80.37) v1(65.13,68.94) v1(65.13,65.13) v1(65.13,61.32) v1(65.13,57.51) v1(65.2,47.04) v1(65.13,30.84) v1(65.13,27.03) v1(65.13,23.22) v1(65.13,11.79) v1(65.13,7.98) v1(65.13,4.17) v1(65.78,54.56) v1(66.4,33.94) v1(66.57,36.93) v1(66.76,46.46) v1(66.93,42.8) v1(67.04,45.11) v1(67.69,39.38) v1(67.8,48.93) v1(68.37,52.35) v1(68.94,95.61) v1(68.94,91.8) v1(68.94,87.99) v1(68.94,84.18) v1(68.94,80.37) v1(68.94,68.94) v1(68.94,65.13) v1(68.94,61.32) v1(68.94,57.51) v1(68.94,42.27) v1(68.94,30.84) v1(68.94,27.03) v1(68.94,23.22) v1(68.94,11.79) v1(68.94,7.98) v1(68.94,4.17) v1(69.59,47.25) v1(70.14,54.33) v1(70.44,39.57) v1(71.39,48.73) v1(71.38,47.39) v1(71.5,51.44) v1(71.61,54.71) v1(71.6,43.11) v1(72.49,51.44) v1(72.55,63.79) v1(72.61,61.11) v1(72.59,58.4) v1(72.56,47.19) v1(72.68,55.95) v1(72.75,95.61) v1(72.75,91.8) v1(72.75,87.99) v1(72.75,84.18) v1(72.75,80.37) v1(72.75,42.27) v1(72.78,39.94) v1(72.75,34.65) v1(72.75,30.84) v1(72.75,27.03) v1(72.75,11.79) v1(72.75,7.98) v1(72.75,4.17) v1(75.59,54.57) v1(75.61,53.29) v1(75.69,42.88) v1(75.68,39.97) v1(75.66,39) v1(75.92,48.79) v1(75.88,47.09) v1(75.86,45.4) v1(76.56,95.61) v1(76.56,91.8) v1(76.56,87.99) v1(76.56,84.18) v1(76.56,80.37) v1(76.56,76.56) v1(76.56,72.75) v1(76.56,68.94) v1(76.56,65.13) v1(76.56,61.32) v1(76.56,34.65) v1(76.56,30.84) v1(76.56,27.03) v1(76.56,23.22) v1(76.56,19.41) v1(76.56,15.6) v1(76.56,11.79) v1(76.56,7.98) v1(76.56,4.17) v1(77.88,47.79) v1(77.94,51.75) v1(77.95,45.17) v1(78.01,42.09) v1(78.09,39.97) v1(78.1,38.83) v1(78.34,54.03) v1(80.37,95.61) v1(80.37,91.8) v1(80.37,87.99) v1(80.37,84.18) v1(80.37,80.37) v1(80.37,76.56) v1(80.37,72.75) v1(80.37,68.94) v1(80.37,65.13) v1(80.37,61.32) v1(80.37,53.7) v1(80.37,49.89) v1(80.37,46.08) v1(80.37,38.46) v1(80.37,34.65) v1(80.37,30.84) v1(80.37,27.03) v1(80.37,23.22) v1(80.37,19.41) v1(80.37,15.6) v1(80.37,11.79) v1(80.37,7.98) v1(80.37,4.17) v1(84.18,95.61) v1(84.18,91.8) v1(84.18,87.99) v1(84.18,84.18) v1(84.18,80.37) v1(84.18,76.56) v1(84.18,72.75) v1(84.18,68.94) v1(84.18,65.13) v1(84.18,61.32) v1(84.18,53.7) v1(84.18,42.27) v1(84.18,30.84) v1(84.18,27.03) v1(84.18,23.22) v1(84.18,19.41) v1(84.18,15.6) v1(84.18,11.79) v1(84.18,7.98) v1(84.18,4.17) v1(87.99,95.61) v1(87.99,87.99) v1(87.99,84.18) v1(87.99,80.37) v1(87.99,76.56) v1(87.99,72.75) v1(87.99,68.94) v1(87.99,65.13) v1(87.99,61.32) v1(87.99,53.7) v1(87.99,49.89) v1(87.99,46.08) v1(87.99,42.27) v1(87.99,38.46) v1(87.99,34.65) v1(87.99,30.84) v1(87.99,27.03) v1(87.99,23.22) v1(87.99,19.41) v1(87.99,15.6) v1(87.99,11.79) v1(87.99,4.17) v1(91.8,95.61) v1(91.8,91.8) v1(91.8,87.99) v1(91.8,84.18) v1(91.8,80.37) v1(91.8,76.56) v1(91.8,72.75) v1(91.8,68.94) v1(91.8,65.13) v1(91.8,61.32) v1(91.8,57.51) v1(91.8,53.7) v1(91.8,49.89) v1(91.8,46.08) v1(91.8,42.27) v1(91.8,38.46) v1(91.8,34.65) v1(91.8,30.84) v1(91.8,27.03) v1(91.8,23.22) v1(91.8,19.41) v1(91.8,15.6) v1(91.8,11.79) v1(91.8,7.98) v1(91.8,4.17)
VCC: length 138.5
  Top Layer w1.27: 7.37,72.34 7.37,72.22 ; 7.37,72.22 7.37,27.69 9.65,25.4 38.78,25.4 C51.1 38.9,17.82 37.9,16.81 Q3.8 ; 7.37,72.22 7.5,85.17 10.46,88.14 27.65,88.14 C46.1 34.25,88.18 35.18,87.25 Q1.8 ; CN1.2 8,71.71
ADC_I2: length 17.4
  Top Layer w0.254: U11.5 57.91,48.64 58.67,47.88 66.93,47.88 68.99,45.82 U7.1 70.42,44.51 R24.2
ADC_IO: length 43.3
  Top Layer w0.61: U11.7 52.83,65.53 52.2,66.17 49.15,66.17 48.54,65.56 U9.3
  Bottom Layer w0.254: U11.7 55.25,53.22 R23.2 72.97,53.02 74.27,53.02
ADC_V: length 5.4
  Top Layer w0.254: R25.2 54.1,47.56 C35.2 54.16,49.59 U11.6
EN_I: length 11.7
  Top Layer w0.61: U10.1 42.67,55.32 R29.1 49.44,53.81 50.29,52.96 U11.8
HB1: length 3.8
  Top Layer w0.61: U13.8 25.59,80.05 C20.2 25.59,83.53 D6.1
HB2: length 3.8
  Top Layer w0.61: D7.1 25.59,16.42 C57.2 25.59,12.99 U14.8
HO1: length 3.6
  Top Layer w0.61: R1.1 R13.1 U13.7
HO2: length 3.6
  Top Layer w0.61: U14.7 R17.1 R15.1
HS1: length 17.3
  Top Layer w0.61: R2.2 37.6,78.75 37.18,78.33 ; 35.28,76.29 34.22,77.34 U13.6 24.64,77.34 24.19,77.79 C20.1
HS2: length 17.3
  Top Layer w0.61: C57.1 24.19,10.73 24.64,10.29 U14.6 34.22,10.29 35.28,9.23 ; R19.2 37.6,11.69 37.18,11.27
I2+: length 26.8
  Top Layer w0.254: U7.3 73.99,45.82 74.17,45.64
  Top Layer w1.27: 74.17,45.64 74.17,24 H2.4 H2.3
IO+: length 29.9
  Top Layer w0.254: v1(75.06,56.77) 74.21,56.77 ; 74.09,48.68 73.83,48.42 U7.4
  Top Layer w1.27: 74.04,56.94 74.04,67.31 72.99,68.36 70.87,68.36 ; H1.3 70.87,68.36 ; 70.87,68.36 H1.4 ; R21.2 74.09,48.68 R22.1
  Bottom Layer w0.254: v1(75.06,56.77) 75.06,55.5 74.48,54.92 74.27,54.92
IO-: length 8.4
  Top Layer w0.254: v1(76.07,56.77) 76.92,56.77 R22.2
  Top Layer w1.27: 82.17,56.9 R22.2
  Bottom Layer w0.254: U6.4 76.65,54.92 76.07,55.5 v1(76.07,56.77)
LO1: length 3.6
  Top Layer w0.61: U13.5 R14.1 R7.1
LO2: length 3.6
  Top Layer w0.61: U14.5 R18.1 R16.1
OUT: length 35
  Top Layer w0.254: R26.2 v1(67.06,40.9)
  Top Layer w1.27: CN2.2 85.85,47.04 85.85,56.64 ; H3.3 H3.4
  Bottom Layer w0.254: CN2.2 83.36,44.88 79.38,40.9 v1(67.06,40.9)
OUT1: length 1.8
  Bottom Layer w1.27: C48.1 C24.2
OUT2: length 1.8
  Bottom Layer w1.27: 59.69,7.3 C53.1
PWM1: length 52.5
  Top Layer w0.254: v1(16.38,78.61) U13.2
  Bottom Layer w0.254: 29.97,35.56 29.97,36.19 16.38,49.78 v1(16.38,78.61)
PWM2: length 61.8
  Top Layer w0.254: v1(15.24,79.88) U13.1
  Bottom Layer w0.254: 32.51,35.56 30.86,33.91 27.31,33.91 26.16,35.05 26.16,36.32 15.24,47.24 v1(15.24,79.88)
PWM3: length 34.3
  Top Layer w0.254: v1(17.27,11.56) U14.2
  Bottom Layer w0.254: v1(17.27,11.56) 17.27,17.78 35.05,35.56
PWM4: length 31.9
  Top Layer w0.254: U14.1 v1(18.8,12.83)
  Bottom Layer w0.254: v1(18.8,12.83) 18.8,16.76 37.59,35.56
$1N1590: length 10.7
  Top Layer w0.61: R8.1 R7.2 30.7,74.42 31.24,73.88 36.73,73.88 37.08,73.53 37.08,72.72
$1N2076: length 2
  Top Layer w0.61: R13.2 30.96,78.61 D1.1
$1N2109: length 2.2
  Top Layer w0.61: R14.2 29.61,76.48 31.24,76.48
$1N2257: length 11.1
  Top Layer w0.61: R1.2 30.32,80.26 D1.2 31.47,81.41 36.7,81.41 37.08,81.03 Q1.4 37.14,80.26 R2.1
$1N3536: length 10.5
  Top Layer w0.61: R16.2 29.2,6.82 ; 29.2,6.82 R20.1 ; 29.2,6.82 29.23,6.86 36.73,6.86 37.08,6.5 37.08,5.66
$1N3551: length 2
  Top Layer w0.61: 31.12,11.4 30.96,11.56 R17.2
$1N3553: length 11.1
  Top Layer w0.61: R15.2 30.34,14.35 36.7,14.35 37.08,13.97 Q3.4 38.81,13.14 R19.1
$1N3586: length 2.1
  Top Layer w0.61: R18.2 31.09,9.02 D4.1
$1N4574: length 8.2
  Top Layer w0.254: R25.1 56.22,44.46 U8.6 58.4,44.47 59.67,43.2 U8.2
$1N4775: length 5.8
  Top Layer w0.254: R26.1 65.53,44.36 C38.2 65.43,44.35 R27.2 63.72,44.47 U8.3
$1N5405: length 4.2
  Top Layer w0.61: U10.2 46.84,56.64 R28.2
$1N5413: length 8.4
  Top Layer w0.61: U9.2 49.81,62 48.54,60.73 U9.6 48.54,56.67 R28.1
$1N5568: length 8.9
  Top Layer w0.61: R30.2 40.92,58.52 41.54,57.91 U10.3 44.79,57.91 C58.2
$1N10041: length 5.8
  Top Layer w0.305: 55.37,35.56 55.36,35.54 H4.3
$1N10045: length 5.8
  Top Layer w0.305: 52.83,35.56 52.83,29.81 H4.4
$1N10154: length 7.9
  Top Layer w0.305: 24.89,35.56 24.89,31.56 SW1.1 26.48,29.97 C59.1
$1N10159: length 9.4
  Top Layer w0.305: 22.35,35.56 22.35,35.11 SW2.1 17.21,29.97 C60.1

## Copper pours and planes (outline as drawn; the poured copper is in the pictures)
GND on Top Layer: -9.78,101.85 105.16,101.85 105.16,-6.22 -9.78,-6.22
GND on Bottom Layer: -8.25,106.43 110.24,106.43 110.24,-12.45 -8.25,-12.45
HS1 on Top Layer: 37.06,78.61 43.56,78.61 43.56,74.55 37.06,74.55
HS1 on Top Layer: 32.88,80.69 36.34,80.69 36.34,77.7 32.88,77.7
HS2 on Top Layer: 37.39,11.48 43.43,11.48 43.43,7.62 37.39,7.62
HS2 on Top Layer: 32.88,13.64 36.19,13.64 36.19,10.76 32.88,10.76
OUT1 on Top Layer: 49.59,82.1 72.34,82.1 72.34,70.82 49.59,70.82
OUT2 on Top Layer: 49.66,19.69 74.93,19.69 74.93,7.28 49.66,7.28

## Text on the board
Top Silkscreen Layer: +12V | VIN+ | I1 | I2 | Io | VOUT
